# EAGLE design pepitaBadge (EAGLE 6.5.0)
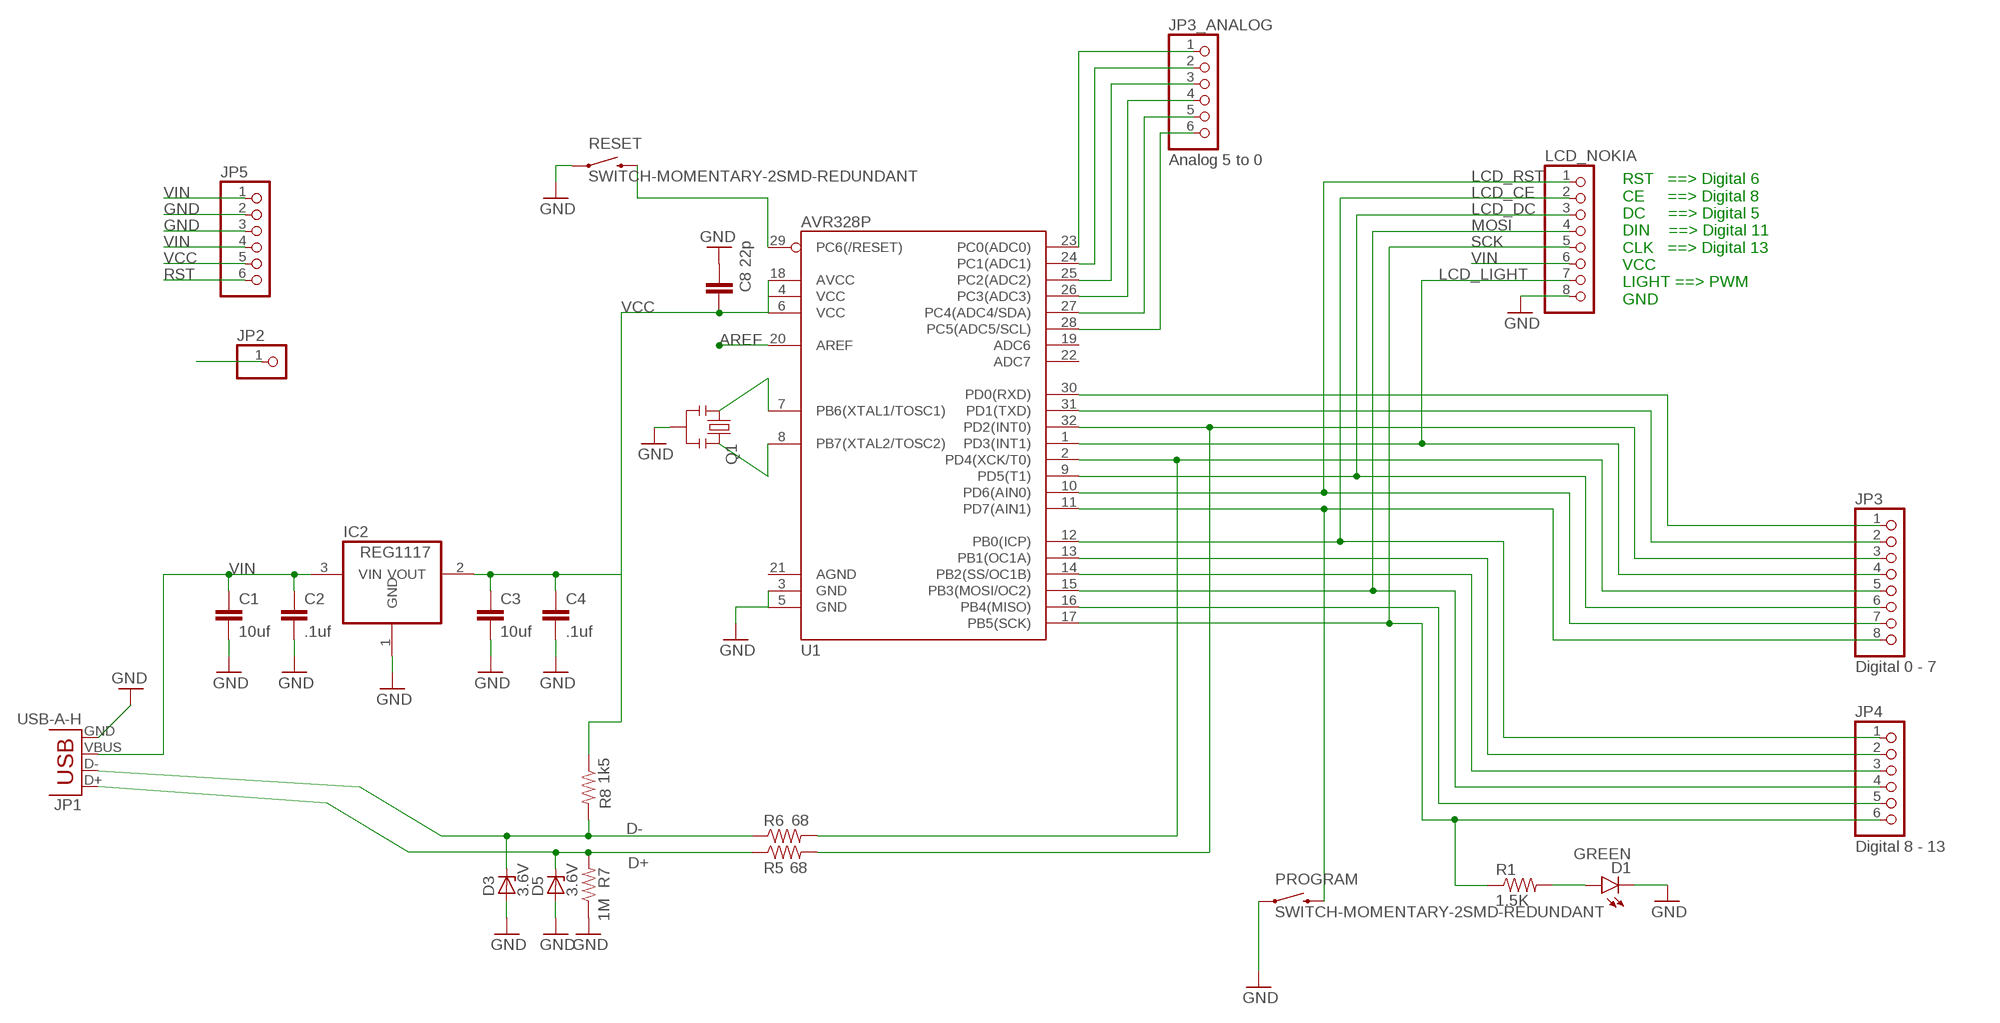
[diagram p0: schematic, sheet 1]

## Parts
C1  10uf  22UF-6.3V-20%(0805)  [0805]
C2  .1uf  CAP0603-CAP  [0603-CAP]
C3  10uf  22UF-6.3V-20%(0805)  [0805]
C4  .1uf  CAP0603-CAP  [0603-CAP]
C8  22p  CAP0603-CAP  [0603-CAP]
D1  GREEN  LED-GREEN0603  [LED-0603]
D3  3.6V  ZENER-DIODE  [1206]
D5  3.6V  ZENER-DIODE  [1206]
IC2  REG1117  [SOT223]
JP1  USB-A-H  [USB-A-H]
JP2  PINHD-1X1  [1X01]
JP3  Digital 0 - 7  PINHD-1X8  [1X08]
JP3_ANALOG  Analog 5 to 0  PINHD-1X6  [1X06]
JP4  Digital 8 - 13  PINHD-1X6  [1X06]
JP5  PINHD-1X6  [1X06]
LCD_NOKIA  PINHD-1X8  [1X08]
PROGRAM  SWITCH-MOMENTARY-2SMD-REDUNDANT  [TACTILE-SWITCH-SMD]
Q1  RESONATOR16MHZ  [RESONATOR-SMD]
R1  1.5K  RESISTOR0603-RES  [0603-RES]
R5  68  RESISTOR0603-RES  [0603-RES]
R6  68  RESISTOR0603-RES  [0603-RES]
R7  1M  RESISTOR0603-RES  [0603-RES]
R8  1k5  RESISTOR0603-RES  [0603-RES]
RESET  SWITCH-MOMENTARY-2SMD-REDUNDANT  [TACTILE-SWITCH-SMD]
U1  AVR328P  ATMEGA328_SMT  [TQFP32-08]

## Nets
A5: JP3_ANALOG.6 U1.28(PC5(ADC5/SCL))
AREF: JP2.1 U1.20(AREF)
D+: D5.2(C) JP1.D+ R5.1 R7.2
D-: D3.2(C) JP1.D- R6.1 R8.2
GND: C1.2 C2.2 C3.2 C4.2 C8.2 D1.C D3.1(A) D5.1(A) IC2.1(GND) JP1.GND JP5.2 JP5.3 LCD_NOKIA.8 PROGRAM.1 PROGRAM.2 Q1.2 R7.1 RESET.1 RESET.2 U1.3(GND) U1.5(GND)
LCD_CE: JP4.1 LCD_NOKIA.2 U1.12(PB0(ICP))
LCD_DC: JP3.6 LCD_NOKIA.3 U1.9(PD5(T1))
LCD_LIGHT: JP3.4 LCD_NOKIA.7 U1.1(PD3(INT1))
LCD_RST: JP3.7 LCD_NOKIA.1 U1.10(PD6(AIN0))
MISO: JP4.5 U1.16(PB4(MISO))
MOSI: JP4.4 LCD_NOKIA.4 U1.15(PB3(MOSI/OC2))
N$1: D1.A R1.2
N$2: JP3_ANALOG.5 U1.27(PC4(ADC4/SDA))
N$3: JP3_ANALOG.4 U1.26(PC3(ADC3))
N$4: JP3_ANALOG.3 U1.25(PC2(ADC2))
N$5: JP3.5 R6.2 U1.2(PD4(XCK/T0))
N$6: JP3_ANALOG.2 U1.24(PC1(ADC1))
N$7: Q1.1 U1.7(PB6(XTAL1/TOSC1))
N$8: JP3_ANALOG.1 U1.23(PC0(ADC0))
N$9: Q1.3 U1.8(PB7(XTAL2/TOSC2))
N$11: JP4.2 U1.13(PB1(OC1A))
N$12: JP4.3 U1.14(PB2(SS/OC1B))
N$26: JP3.3 R5.2 U1.32(PD2(INT0))
PD7: JP3.8 PROGRAM.3 PROGRAM.4 U1.11(PD7(AIN1))
RST: JP5.6 RESET.3 RESET.4 U1.29(PC6(/RESET))
RXD: JP3.1 U1.30(PD0(RXD))
SCK: JP4.6 LCD_NOKIA.5 R1.1 U1.17(PB5(SCK))
TXD: JP3.2 U1.31(PD1(TXD))
VCC: C3.1 C4.1 C8.1 IC2.2(VOUT) JP5.5 R8.1 U1.4(VCC) U1.6(VCC) U1.18(AVCC)
VIN: C1.1 C2.1 IC2.3(VIN) JP1.VBUS JP5.1 JP5.4 LCD_NOKIA.6
Unconnected: U1.19(ADC6) U1.21(AGND) U1.22(ADC7)

## Notes on the sheet
- RST   ==> Digital 6
  CE     ==> Digital 8
  DC     ==> Digital 5
  DIN    ==> Digital 11
  CLK   ==> Digital 13
  VCC
  LIGHT ==> PWM
  GND

## Library data of the parts
C1 C3 = SparkFun-Capacitors:22UF-6.3V-20%(0805): CAP-08402 Ceramic; PROD_ID: CAP-08402; VALUE: 22uF
C2 C4 C8 = SparkFun-Passives:CAP: Capacitor Standard 0603 ceramic capacitor, and 0.1" leaded capacitor.
D1 = SparkFun-LED:LED-GREEN: Various green LEDs Green LEDs used in SFE Production 0603- DIO-00821 LARGE- DIO-00862 LILYPAD- DIO-09910; PROD_ID: DIO-00821
D3 D5 = digital-ic:ZENER-DIODE: Z-Diode
IC2 = burr-brown:REG1117: 800mA and 1A Low Dropout (LDO) Positive Regulator 1.8V, 2.5V, 2.85V, 3.3V, 5V, and Adj; MPN: REG1117; OC_FARNELL: 1097566; OC_NEWARK: 14P6981
JP1 = SparkFun-Connectors:USB: USB Connectors USB-B-PTH is fully proven SKU : PRT-00139/CONN-08278 USB-miniB is fully proven SKU : PRT-00587 USB-A-PCB is untested. USB-A-H is throughly reviewed, but untested. Spark Fun Electronics SKU : PRT-00437 USB-B-SMT is throughly reviewed, but untested. Needs silkscreen touching up. USB-A-S has not been used/tested USB-MB-H has not been used/tested USB-MICROB has been used. CONN-09505; PROD_ID: CONN-08367
JP2 = pinhead:PINHD-1X1: PIN HEADER
JP3 LCD_NOKIA = pinhead:PINHD-1X8: PIN HEADER
JP3_ANALOG JP4 JP5 = pinhead:PINHD-1X6: PIN HEADER
PROGRAM RESET = SparkFun-Electromechanical:SWITCH-MOMENTARY-2: Various NO switches- pushbuttons, reed, etc
Q1 = SparkFun-FreqCtrl_Modified:RESONATOR: Resonator Small SMD resonator. Used, eg, on the Arduino Pro/ Pro Mini boards. 8MHz- XTAL-08895 16MHz- XTAL-08900; PROD_ID: XTAL-08900; VALUE: 16MHZ
R1 R5-R8 = SparkFun-Passives:RESISTOR: Resistor Basic schematic elements and footprints for 0603, 1206, and PTH resistors.
U1 = SparkFun-DigitalIC:ATMEGA328_SMT: 32-Pin Atmega328 part Commonly used on Arduino compatible boards Available in QFP and QFN packages TQFP is IC-09069 QFN is non-stock; PROD_ID: IC-09069; VALUE: ATMEGA328P

## Board
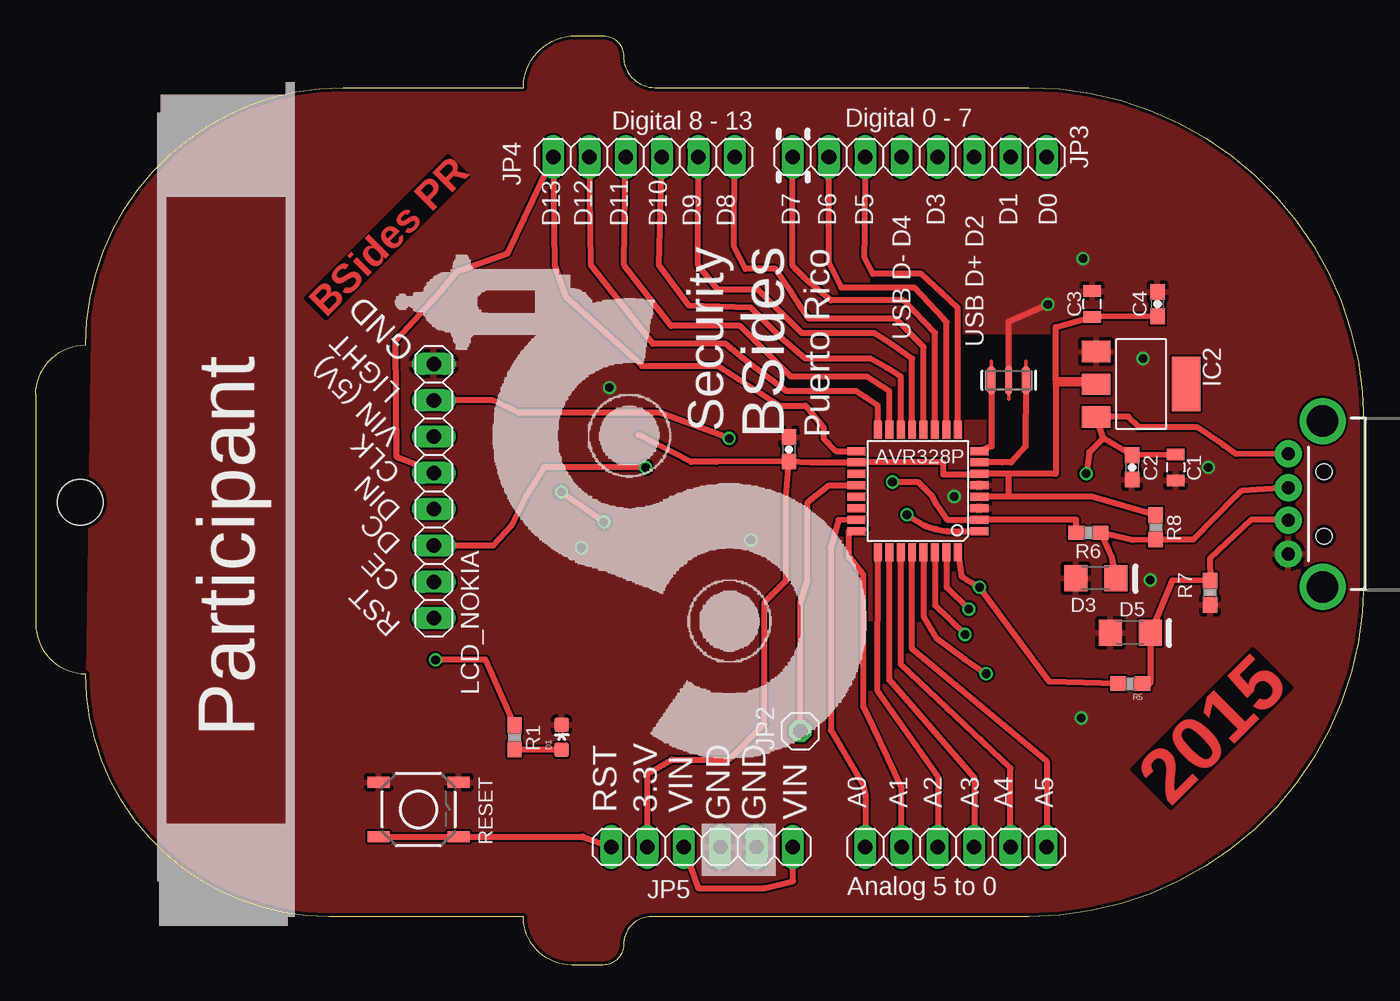
[diagram p1: board, top side]
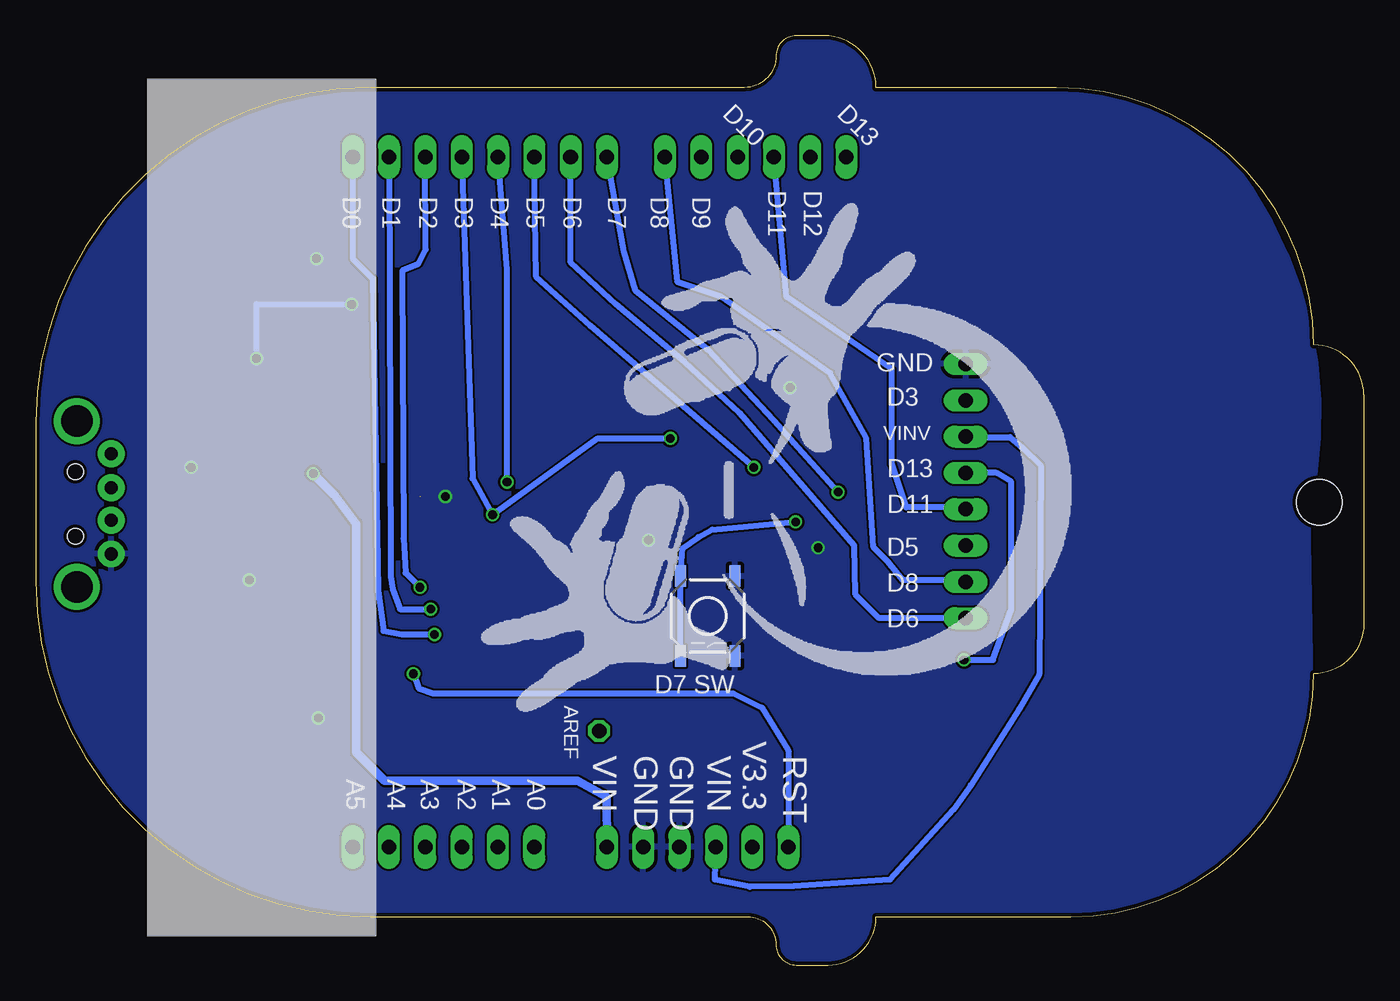
[diagram p2: board, bottom side, seen from below]

Size 92.92 x 65 mm. Coordinates in mm from the lower left corner, seen from the top.
Outline: 0,39.88 0,23.88 arc90 3.5,20.38 arc90 20.5,3.38 34.12,3.38 arc90 37.5,0 39.71,0 arc90 41.12,1.41 arc-90 43.09,3.38 69.5,3.38 arc90 92.92,26.85 92.92,37.95 arc90 69.5,61.38 43.34,61.38 arc-90 41.12,63.59 arc90 39.71,65 37.75,65 arc90 34.12,61.38 21.5,61.38 arc90 3.5,43.38 arc90 0,39.88
Copper layers (1*16): Top 0.035mm / dielectric 1.5mm / Bottom 0.035mm
Design rules "SeeedStudio_2layer_DRU_no_angle_20140221": minimum track width 6mil, minimum drill 12mil, track to track 6mil, track to pad 6mil, pad to pad 6mil, via to via 6mil, smd to smd 0mil, copper to edge 10mil, drill to drill 10mil, minimum pad ring 10mil, minimum via ring 6mil, stop-mask expansion 2mil, vias tented up to drill 100mil, thermal gap 10mil
Holes 3.2 mm at 3.12,32.38

### Footprints (pad centres in the part's own frame; a part is rotated, then mirrored left to right if it is on the bottom)
0805 = smd 0.8 x 1.2: 1 -0.9,0; 2 0.9,0
0603-CAP = smd 1.1 x 1: 1 -0.85,0; 2 0.85,0
LED-0603 = smd 1 x 1: A 0,-0.877; C 0,0.877
1206 = smd 1.6 x 1.8: 1 -1.4,0; 2 1.4,0
SOT223 = smd 1.499 x 2.007: 1 -2.261,-3.15; 2 0.025,-3.15; 3 2.311,-3.15 | smd 3.81 x 2.007: 4 0,3.15
USB-A-H = drill 0.914 pad 1.88: D+ 2.4,1.127; D- 2.4,-1.127; GND 2.4,3.5; VBUS 2.4,-3.5 | drill 2.2: GND2 0,-5.8; GND3 0,5.8 | hole 1.1: -0.1,2.25; -0.1,-2.25
1X01 = drill 1.016 octagon: 1 0,0
1X08 = drill 1.016 long: 1 -8.89,0; 2 -6.35,0; 3 -3.81,0; 4 -1.27,0; 5 1.27,0; 6 3.81,0; 7 6.35,0; 8 8.89,0
1X06 = drill 1.016 long: 1 -6.35,0; 2 -3.81,0; 3 -1.27,0; 4 1.27,0; 5 3.81,0; 6 6.35,0
TACTILE-SWITCH-SMD = smd 1.524 x 0.762: 1 -2.794,1.905; 2 2.794,1.905; 3 -2.794,-1.905; 4 2.794,-1.905
RESONATOR-SMD = smd 0.61 x 2.032: 1 -1.2,0; 3 1.2,0 | smd 0.45 x 2.032: 2 0,0
0603-RES = smd 1.1 x 1: 1 -0.85,0; 2 0.85,0
TQFP32-08 = smd 1.27 x 0.559: 1 -4.293,2.8; 2 -4.293,2; 3 -4.293,1.2; 4 -4.293,0.4; 5 -4.293,-0.4; 6 -4.293,-1.2; 7 -4.293,-2; 8 -4.293,-2.8; 17 4.293,-2.8; 18 4.293,-2; 19 4.293,-1.2; 20 4.293,-0.4; 21 4.293,0.4; 22 4.293,1.2; 23 4.293,2; 24 4.293,2.8 | smd 0.559 x 1.27: 9 -2.8,-4.293; 10 -2,-4.293; 11 -1.2,-4.293; 12 -0.4,-4.293; 13 0.4,-4.293; 14 1.2,-4.293; 15 2,-4.293; 16 2.8,-4.293; 25 2.8,4.293; 26 2,4.293; 27 1.2,4.293; 28 0.4,4.293; 29 -0.4,4.293; 30 -1.2,4.293; 31 -2,4.293; 32 -2.8,4.293

### Placement (x,y rotation side)
C1  79.76,34.8 270 top
C2  76.71,34.8 270 top
C3  73.92,46.23 90 top
C4  78.49,46.23 90 top
C8  52.71,36.07 90 top
D1  36.8,15.92 0 top
D3  74.17,27.06 0 top
D5  76.58,23.25 0 top
IC2  77.35,40.65 270 top
JP1  90.05,32.25 180 top
JP2  53.5,16.38 90 top
JP3  61.85,56.52 180 top
JP3_ANALOG  64.39,8.27 0 top
JP4  42.55,56.52 180 top
JP5  46.61,8.27 180 top
LCD_NOKIA  27.85,33.15 90 top
PROGRAM  45.9,24.42 270 bottom
Q1  68.08,40.9 180 top
R1  33.51,15.92 270 top
R5  76.58,19.69 180 top
R6  73.66,30.23 180 top
R7  82.17,26.04 90 top
R8  78.36,30.61 270 top
RESET  26.79,10.88 0 top
U1  61.73,33.15 180 top
U$2  [OBSIDISLOGO_BOTTOM]  61.75,17.75 90 top
U$5  [BSIDES_LOGO_NTB_PIC_ONLY]  56.88,17 90 top

### Tracks (layer width: path | path; a pad name or v marks a point on that pad's centre or on a via)
A5
  Top 0.406: JP3_ANALOG.6 70.74,14.24 61.33,22.13 U1.28
AREF
  Top 0.406: JP2.1 53.5,25.38 54,26.88 54,32.38 55.5,33.55 U1.20
D+
  Top 0.406: JP1.D+ 87.12,31.13 85.04,31.14 82.16,28.44 R7.2 79.52,26.9 D5.2 77.98,19.69 R5.1
D-
  Top 0.406: JP1.D- 84.37,33.16 83.95,32.78 81.01,29.76 R8.2 76.75,29.72 R6.1 75.28,28.58 D3.2
GND  (via drill 0.61)
  Top 0.406: Q1.2 68.08,45.02 v70.82,46.21
  Bottom 0.406: v77.47,42.42 77.47,46.23 v70.82,46.21
  other vias: 38.18,29.19 40.14,40.39 50.04,29.72 73.16,17.28 77.98,26.93 82.05,34.8 64.27,32.77 73.28,49.41
  pour Top (isolate 0.018): 42.4,3.25 70.73,3.67 arc82 92.28,22.92 92.63,25.67 92.6,26.36 92.91,38.28 93.03,40.82 91.56,45.63 arc72 70.84,61.24 63.8,61.35 41.98,61.55 41.02,63.83 41.02,64.9 39.27,64.9 39.27,65 37.35,65 37.35,64.67 35.7,64.67 35.7,64.08 34.67,64.08 34.67,63 34.45,63 34.45,61.4 19.12,61.4 12.28,59.3 7.2,54.35 4.12,49 3.62,15.3 9.62,6.55 17.88,3.25 34.21,3.2 arc1 34.22,2.77 34.25,2.6 34.25,1.85 34.52,1.85 34.52,1.1 35.05,1.1 35.05,0.58 35.67,0.58 35.67,0.12 36.45,0.12 36.45,0.08 40.62,0.08 40.62,0.75 41.12,0.75 41.12,1.68 41.33,1.68 41.33,2.5 41.85,2.5 41.85,3.1 42.4,3.1
  pour Bottom (isolate 0.016): 11.13,58.38 arc57 3.94,31.69 3.67,15.34 9,6.84 17.23,3.5 18.45,3.4 22.95,3.4 32.4,3.4 33,3.25 34.12,3.33 34.3,1.23 35.48,1.23 35.48,0.35 39.7,0.35 39.7,-0.15 41.25,-0.15 41.25,1.62 41.55,1.62 41.55,3.1 44.16,3.3 72.2,3.48 arc87 92.83,25.2 92.83,26.06 92.95,26.06 92.75,42.71 arc86 62.84,61.22 43,61.37 42.7,62.05 41.4,62.05 41.4,63.55 41.1,63.55 41.1,64.92 36.08,64.92 36.08,64.97 35.6,64.97 35.6,63.83 34.5,63.83 34.5,62.98 34.23,62.98 34.23,61.83 34.27,61.83 34.27,61.4 19.02,61.02 19.02,61.55
LCD_CE
  Top 0.406: U1.12 62.13,43.24 60.2,45.22 54.11,45.22 53.49,46.11 52.83,47.16 51.77,48.7 49.66,48.7 48.87,50.24 JP4.1
  Bottom 0.406: LCD_NOKIA.2 27.85,26.93 32.26,26.93 33.28,28.2 34.29,29.22 34.8,36.84 37.34,41.41 44.96,46.74 48.01,47.76 JP4.1
LCD_DC  (via drill 0.61)
  Top 0.406: U1.9 64.53,45.98 63.38,47.05 61.98,48.34 58.58,48.34 57.99,49.46 58.02,51.09 JP3.6 | v42.68,34.8 35.56,34.8 34.29,32.77 33.28,30.74 32.01,29.34 LCD_NOKIA.3
  Bottom 0.406: v42.68,34.8 54.11,44.71 57.92,48.14 JP3.6
LCD_LIGHT  (via drill 0.61)
  Top 0.406: v60.96,31.5 62.23,30.74 63,30.49 63.76,30.35 U1.1 | v48.52,36.84 43.69,38.61 33.79,38.61 32.01,39.5 LCD_NOKIA.7
  Bottom 0.406: JP3.4 62.36,34.04 v60.96,31.5 53.6,36.84 v48.52,36.84
LCD_RST
  Top 0.406: U1.10 63.73,44.96 63.5,45.22 61.47,47.38 56.37,47.38 55.5,49.16 JP3.7
  Bottom 0.406: LCD_NOKIA.1 33.91,24.26 35.56,25.91 35.64,29.34 43.69,38.61 47.5,42.17 52.33,46.23 55.5,49.16 JP3.7
MISO
  Top 0.406: U1.16 58.93,39.12 58.09,39.68 57.41,40.14 52.53,40.14 49.53,42.42 48.26,43.44 43.18,43.44 38.85,48.96 JP4.5
MOSI
  Top 0.406: U1.15 59.73,40.14 58.17,41.15 52.84,41.15 49.28,44.71 44.45,44.71 41.16,48.96 JP4.4
  Bottom 0.406: LCD_NOKIA.4 27.85,32.01 32.01,32.01 33.02,35.06 33.02,41.66 40.39,46.74 JP4.4
N$1
  Top 0.406: D1.A 35.3,15.07 R1.2
N$2
  Top 0.406: JP3_ANALOG.5 68.2,13.79 60.53,21.05 U1.27
N$3
  Top 0.406: JP3_ANALOG.4 65.66,13.11 59.73,19.95 U1.26
N$4
  Top 0.406: JP3_ANALOG.3 63.12,13.2 58.9,19.18 U1.25
N$5  (via drill 0.61)
  Top 0.406: v59.95,33.79 61.73,33.79 62.74,32.77 63,32.26 63.76,31.15 U1.2 72.81,31.15 R6.2
  Bottom 0.406: v59.95,33.79 59.95,48.65 JP3.5
N$6
  Top 0.254: 58.17,30.49 U1.24
  Top 0.406: JP3_ANALOG.2 60.58,12.4 58.64,16.54 57.92,18.06 57.92,27.31 56.9,28.58 56.9,30.35 U1.24
N$7
  Top 0.406: Q1.1 69.26,36.27 68.25,35.15 67.62,35.16 U1.7
N$8
  Top 0.406: U1.23 56.16,31.12 55.63,29.22 55.63,16.42 57.93,12.55 58.04,11.87 JP3_ANALOG.1
N$9
  Top 0.406: Q1.3 66.88,36.27 U1.8
N$10
  cutout Top (isolate 0.305): 71,38.38 71,43.88 65,43.88 65,38.38
N$11
  Top 0.406: U1.13 61.33,42.42 59.85,43.44 58.68,44.2 53.6,44.2 50.55,47.25 47.74,47.25 46.34,48.96 JP4.2
N$12
  Top 0.406: U1.14 60.53,41.15 59.57,41.77 58.42,42.42 53.85,42.42 52.07,43.95 50.04,45.98 45.7,46.12 43.6,48.96 JP4.3
N$26  (via drill 0.61)
  Top 0.406: U1.32 64.78,27.18 v66.04,26.42 70.91,19.82 R5.2
  Bottom 0.406: v66.04,26.42 67.06,27.44 67.19,29.85 67.29,48.55 66.17,49.03 65.64,50.04 JP3.3
PD7  (via drill 0.61)
  Top 0.406: U1.11 62.93,44.2 60.71,46.49 55.63,46.49 53.98,47.89 52.96,48.9 JP3.8 | v36.78,33.08 38.13,32.16 v39.76,30.99
  Bottom 0.406: v36.78,33.08 39.88,36.51 41.25,38.05 45.93,43.06 50.96,47.15 51.77,49.89 JP3.8 | v39.76,30.99 45.6,30.46 46.56,29.93 47.65,29.14 PROGRAM.3 PROGRAM.4
RST  (via drill 0.61)
  Top 0.406: RESET.3 RESET.4 38.26,8.97 JP5.6 | U1.29 62.13,24.38 63,22.88 65,21.38 v66.5,20.38
  Bottom 0.406: v66.5,20.38 66.12,19.38 65.12,19 44.12,19 42.12,18 40.26,15 JP5.6
RXD  (via drill 0.61)
  Top 0.406: U1.30 62.93,25.15 v65.03,23.12
  Bottom 0.406: JP3.1 70.74,49.41 69.35,48.01 68.97,26.17 68.58,23.37 67.31,23.12 v65.03,23.12
SCK  (via drill 0.61)
  Top 0.406: R1.1 31.47,21.36 v27.98,21.34 | U1.17 56.01,35.95 55.12,36.84 55.12,37.61 53.85,39.12 52.07,39.12 47.76,41.92 42.42,41.92 37.08,46.75 36.31,48.96 JP4.6 33.02,49.79 29.5,48.52 28.23,47 25.19,43.69 25.25,35.52 27.85,34.55 LCD_NOKIA.5
  Bottom 0.406: v27.98,21.34 25.94,21.34 24.67,24.9 24.67,33.79 25.69,34.42 LCD_NOKIA.5
TXD  (via drill 0.61)
  Top 0.406: U1.31 63.73,26.42 v65.28,24.9
  Bottom 0.406: JP3.2 68.08,27.18 67.95,26.3 67.44,24.9 v65.28,24.9
VCC  (1 unrouted)
  Top 0.406: C4.1 C3.1 71.38,44.62 71.38,40.9 74.2,40.9 IC2.2 74.2,40.65 71.38,40.65 71.38,34.35 68.08,34.35 | 66.02,32.77 68.08,32.77 | 68.08,32.77 68.08,34.35 | 68.08,34.35 U1.6 66.02,34.3 63.5,34.3 63.5,35.15 U1.18 54.23,35.15 C8.1 | 68.08,32.77 73.79,32.77 R8.1 | C8.1 47.63,35.19 45.85,35.19 42.17,37.09 | JP5.5 42.8,13.38 44.5,14.38 48.5,14.38 51,16.88 51,25.38 52.5,26.88 52.5,32.72 C8.1
VIN  (via drill 0.61)
  Top 0.406: C1.1 C2.1 74.71,36.84 | JP1.VBUS 84.01,35.73 83.12,36.34 81.28,37.6 77.22,37.6 76.46,38.36 IC2.3 74.71,36.84 | JP5.4 46.34,5.38 51,5.38 53,5.88 53,8.27 JP5.1 | 74.71,36.84 73.71,35.88 v73.5,34.38
  Bottom 0.406: LCD_NOKIA.6 27.85,36.92 24.75,36.92 23.9,36.17 22.6,34.92 22.7,20.32 24.1,17.93 27.5,12.57 28.7,10.88 33.15,5.97 39.9,5.53 42.95,5.47 45.4,5.96 JP5.4
  Bottom 0.61: v73.5,34.38 72,32.88 70.5,30.88 70.5,14.88 68.5,12.88 55,12.88 53,11.77 JP5.1

### Text on the board
Top: BSides PR | 2015
tPlace: D13 | D12 | D11 | D10 | D9 | D8 | D7 | D6 | D5 | D3 | D1 | D0 | USB D- D4 | GND | USB D+ D2 | LIGHT | VIN (5V) | CLK | DIN | DC | CE | RST | Participant | RST | 3.3V | VIN | A0 | A1 | A2 | A3 | A4 | A5 | GND | GND | VIN
bPlace: D13 | D10 | D12 | D11 | D9 | D8 | D7 | D6 | D5 | D4 | D3 | D2 | D1 | D0 | GND | D3 | VINV | D13 | D11 | D5 | D8 | D7 SW | V3.3 | RST | VIN | GND | GND | VIN | A0 | A1 | A2 | A3 | A4 | A5
tNames: Security | BSides | Puerto Rico
bNames: D6 | AREF